# Altium schematic sheet MCP23017-E_SS1_MCP23017-E_SS.schdoc
size 127 x 99 mm
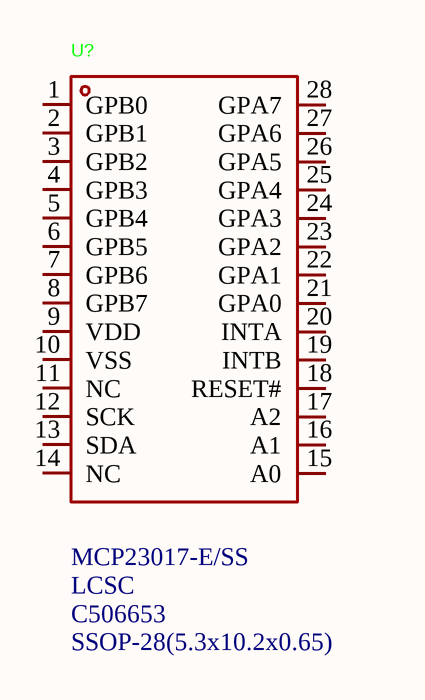
[diagram p0: MCP23017-E_SS1_MCP23017-E_SS.schdoc]

## Parts
U?  Supplier Part: C506653  Supplier Footprint: SSOP-28(5.3x10.2x0.65)  Supplier: LCSC  [SSOP-28_L10.2-W5.3-P0.65-LS7.8-BL]  (hidden comment: MCP23017-E/SS)

## Nets

Not connected (* = marked no-connect by the designer): U? 1(GPB0) 2(GPB1) 3(GPB2) 4(GPB3) 5(GPB4) 6(GPB5) 7(GPB6) 8(GPB7) 9(VDD) 10(VSS) 11(NC) 12(SCK) 13(SDA) 14(NC) 15(A0) 16(A1) 17(A2) 18(RESET#) 19(INTB) 20(INTA) 21(GPA0) 22(GPA1) 23(GPA2) 24(GPA3) 25(GPA4) 26(GPA5) 27(GPA6) 28(GPA7)

## Library data of the parts
U? = MCP23017-E/SS: Manufacturer: MICROCHIP(美国微芯); Add into BOM: yes; Interface: I2C; Number of I/O: 16; Voltage - Supply: 1.8V~5.5V; Current - Output Low(IOL): 8mA; Clock Frequency: 1.7MHz; Number of Supporting Devices: 8; Quiescent Current: 1uA; Output Logic Level - Low: 600mV; Symbol: MCP23017-E/SS; Device: MCP23017-E/SS; Manufacturer Part: MCP23017-E/SS; LCSC Part Name: 16位带串行接口的I/O扩展器; JLCPCB Part Class: Extended Part; Datasheet: https://item.szlcsc.com/datasheet/MCP23017-E%252FSS/519857.html; Convert to PCB: yes; Interrupt Output: Interrupt Output; Output Type: -; Current - Output High(IOH): -; Operating Temperature: -40℃~+125℃